# EAGLE design Lighting Board (EAGLE 6.5.0)
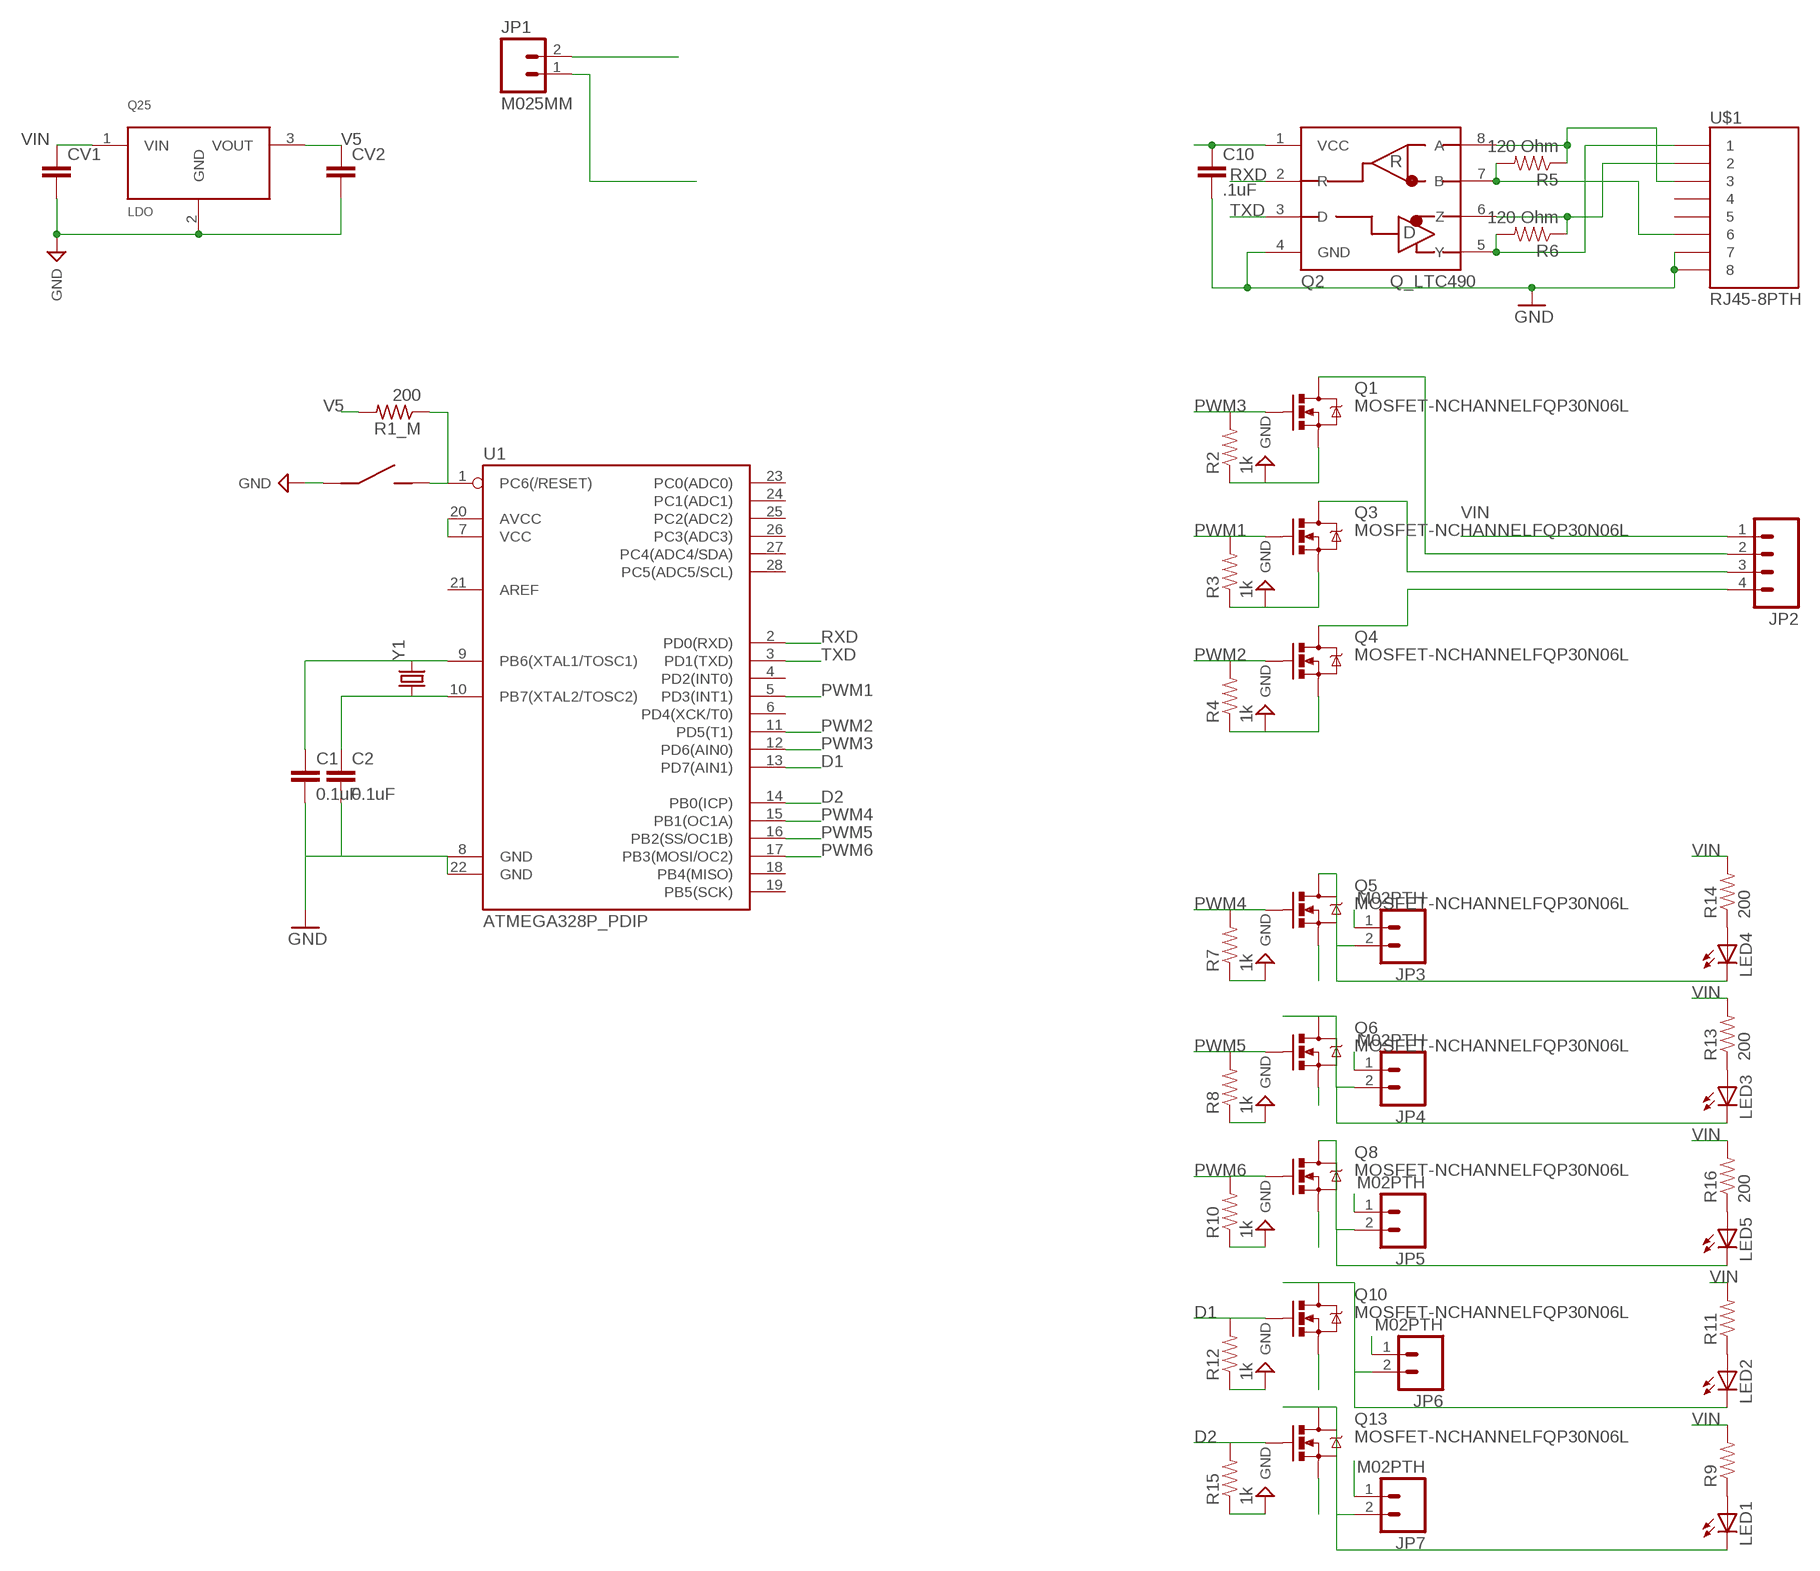
[diagram p0: schematic, sheet 1]

## Parts
C1  0.1uF  CAP1206  [1206]
C2  0.1uF  CAP1206  [1206]
C10  .1uF  2.2UF-CERCAP-10009  [1206]
CV1  C_CAP_0805  [C_0805]
CV2  C_CAP_0805  [C_0805]
JP1  M025MM  [SCREWTERMINAL-5MM-2]
JP2  M04PTH  [1X04]
JP3  M02PTH  [1X02]
JP4  M02PTH  [1X02]
JP5  M02PTH  [1X02]
JP6  M02PTH  [1X02]
JP7  M02PTH  [1X02]
LED1  LED1206  [LED-1206]
LED2  LED1206  [LED-1206]
LED3  LED1206  [LED-1206]
LED4  LED1206  [LED-1206]
LED5  LED1206  [LED-1206]
MS  J_MC32857  [J_TOGGLE]
Q1  MOSFET-NCHANNELFQP30N06L  [TO220V]
Q2  Q_LTC490  [DIP8]
Q3  MOSFET-NCHANNELFQP30N06L  [TO220V]
Q4  MOSFET-NCHANNELFQP30N06L  [TO220V]
Q5  MOSFET-NCHANNELFQP30N06L  [TO220V]
Q6  MOSFET-NCHANNELFQP30N06L  [TO220V]
Q8  MOSFET-NCHANNELFQP30N06L  [TO220V]
Q10  MOSFET-NCHANNELFQP30N06L  [TO220V]
Q13  MOSFET-NCHANNELFQP30N06L  [TO220V]
Q25  LDO  Q_LDO  [TO-220]
R1_M  200  R_RES_0805  [R_0805]
R2  1k  RESISTOR1206  [1206]
R3  1k  RESISTOR1206  [1206]
R4  1k  RESISTOR1206  [1206]
R5  120 Ohm  RESISTOR1206  [1206]
R6  120 Ohm  RESISTOR1206  [1206]
R7  1k  RESISTOR1206  [1206]
R8  1k  RESISTOR1206  [1206]
R9  RESISTOR1206  [1206]
R10  1k  RESISTOR1206  [1206]
R11  RESISTOR1206  [1206]
R12  1k  RESISTOR1206  [1206]
R13  200  RESISTOR1206  [1206]
R14  200  RESISTOR1206  [1206]
R15  1k  RESISTOR1206  [1206]
R16  200  RESISTOR1206  [1206]
U1  ATMEGA328P_PDIP  [DIL28-3]
U$1  RJ45-8PTH  [RJ45-8]
Y1  CRYSTALHC49US  [HC49US]

## Nets
D1: Q10.1(G) R12.2 U1.13(PD7(AIN1))
D2: Q13.1(G) R15.2 U1.14(PB0(ICP))
GND: C1.2 C2.2 C10.2 CV1.2 CV2.2 JP1.2 MS.P$1 Q1.3(S) Q2.4(GND) Q3.3(S) Q4.3(S) Q5.3(S) Q6.3(S) Q8.3(S) Q10.3(S) Q13.3(S) Q25.2(GND) R2.1 R3.1 R4.1 R7.1 R8.1 R10.1 R12.1 R15.1 U1.8(GND) U1.22(GND) U$1.7 U$1.8 ; supply symbol labelled SUP_GND
N$1: Q2.5(Y) R6.2 U$1.1
N$2: C2.1 U1.10(PB7(XTAL2/TOSC2)) Y1.1
N$4: LED1.A R9.1
N$5: LED2.A R11.1
N$6: LED3.A R13.1
N$7: LED4.A R14.1
N$8: LED5.A R16.1
N$9: Q2.6(Z) R6.1 U$1.2
N$10: Q2.7(B) R5.2 U$1.6
N$11: Q2.8(A) R5.1 U$1.3
N$13: C1.1 U1.9(PB6(XTAL1/TOSC1)) Y1.2
N$15: JP2.2 Q1.2(D)
N$16: JP2.3 Q3.2(D)
N$17: JP2.4 Q4.2(D)
N$88: MS.P$2 R1_M.1 U1.1(PC6(/RESET))
N%2: JP4.2 LED3.C Q6.2(D)
N%3: JP3.2 LED4.C Q5.2(D)
N%106: JP5.2 LED5.C Q8.2(D)
N%107: JP6.2 LED2.C Q10.2(D)
N%110: JP7.2 LED1.C Q13.2(D)
PWM1: Q3.1(G) R3.2 U1.5(PD3(INT1))
PWM2: Q4.1(G) R4.2 U1.11(PD5(T1))
PWM3: Q1.1(G) R2.2 U1.12(PD6(AIN0))
PWM4: Q5.1(G) R7.2 U1.15(PB1(OC1A))
PWM5: Q6.1(G) R8.2 U1.16(PB2(SS/OC1B))
PWM6: Q8.1(G) R10.2 U1.17(PB3(MOSI/OC2))
RXD: Q2.2(R) U1.2(PD0(RXD))
TXD: Q2.3(D) U1.3(PD1(TXD))
V5: C10.1 CV2.1 Q2.1(VCC) Q25.3(VOUT) R1_M.2 U1.7(VCC) U1.20(AVCC)
VIN: CV1.1 JP1.1 JP2.1 JP3.1 JP4.1 JP5.1 JP6.1 JP7.1 Q25.1(VIN) R9.2 R11.2 R13.2 R14.2 R16.2
Unconnected: U1.4(PD2(INT0)) U1.6(PD4(XCK/T0)) U1.18(PB4(MISO)) U1.19(PB5(SCK)) U1.21(AREF) U1.23(PC0(ADC0)) U1.24(PC1(ADC1)) U1.25(PC2(ADC2)) U1.26(PC3(ADC3)) U1.27(PC4(ADC4/SDA)) U1.28(PC5(ADC5/SCL)) U$1.4 U$1.5

## Library data of the parts
C1 C2 = SparkFun-Passives:CAP: Capacitor Standard 0603 ceramic capacitor, and 0.1" leaded capacitor.
C10 = SparkFun-Retired:2.2UF-CER: 2.2uF Ceramic SMT CAP-07888- 10V, 20% (0603) CAP-10009- 50V, 10% (1206); PROD_ID: CAP-10009; VALUE: 2.2uF
CV1 CV2 = Lib_Passive:C_CAP
JP1 JP3-JP7 = SparkFun-Connectors:M02: Standard 2-pin 0.1" header. Use with - straight break away headers ( PRT-00116) - right angle break away headers (PRT-00553) - swiss pins (PRT-00743) - machine pins (PRT-00117) - female headers (PRT-00115) Molex polarized connector foot print use with: PRT-08233 with associated crimp pins and housings. 2.54_SCREWTERM for use with PRT-10571. 3.5mm Screw Terminal footprints for PRT-08084 5mm Screw Terminal footprints for use with PRT-08433
JP2 = SparkFun-Connectors:M04: Header 4 Standard 4-pin 0.1" header. Use with straight break away headers (SKU : PRT-00116), right angle break away headers (PRT-00553), swiss pins (PRT-00743), machine pins (PRT-00117), and female headers (PRT-00115). Molex polarized connector foot print use with SKU : PRT-08231 with associated crimp pins and housings. 1MM SMD Version SKU: PRT-10208
LED1-LED5 = LilyPad-Wearables:LED: LEDs Standard schematic elements and footprints for 5mm, 3mm, 1206, and 0603 sized LEDs. 5mm - Spark Fun Electronics SKU : Comp-SBL
MS = PCB0M1:J_MC32857: SWITCH, TACTILE, SPST-NO, 50mA, THD
Q1 Q3-Q6 Q8 Q10 Q13 = SparkFun-DiscreteSemi:MOSFET-NCHANNEL: Common NMOSFET Parts MFG P/N Store ID Prod ID FDD8780 TRANS-09984 SI7820DN TRANS-11055 FDS6630A IC-08089 2N7002PW TRANS-11151 FQP30N06L COM-10213 TRANS-10060 BSS123LT1G TRANS-08345 BSS138 TRANS-00830 BS170 2N7000; PROD_ID: TRANS-10060
Q2 = PCB0M1:Q_LTC490: IC, RS422-RS485 DRVR
Q25 = PCB0M1:Q_LDO: LDO with fixed ouput voltage
R1_M = Lib_Passive:R_RES
R2-R16 = SparkFun-Passives:RESISTOR: Resistor Basic schematic elements and footprints for 0603, 1206, and PTH resistors.
U1 = SparkFun-DigitalIC:ATMEGA328P_PDIP: uC used in the Arduino 32kb flash, 1k EEPROM, 2k SRAM This is the through-hole version of this chip.
U$1 = SparkFun-Connectors:RJ45-8: RJ45 Jack Simple RJ45, 8-pin connection - connector for common Cat5, Cat5e, and Cat6 Ethernet cables. Footprint not yet proven in production. Connector sku is PRT-00643; Breakout PCB sku is BOB-00716.
Y1 = SparkFun-FreqCtrl:CRYSTAL: Various standard crystals. Proven footprints. Spark Fun Electronics SKU : COM-00534

## Board
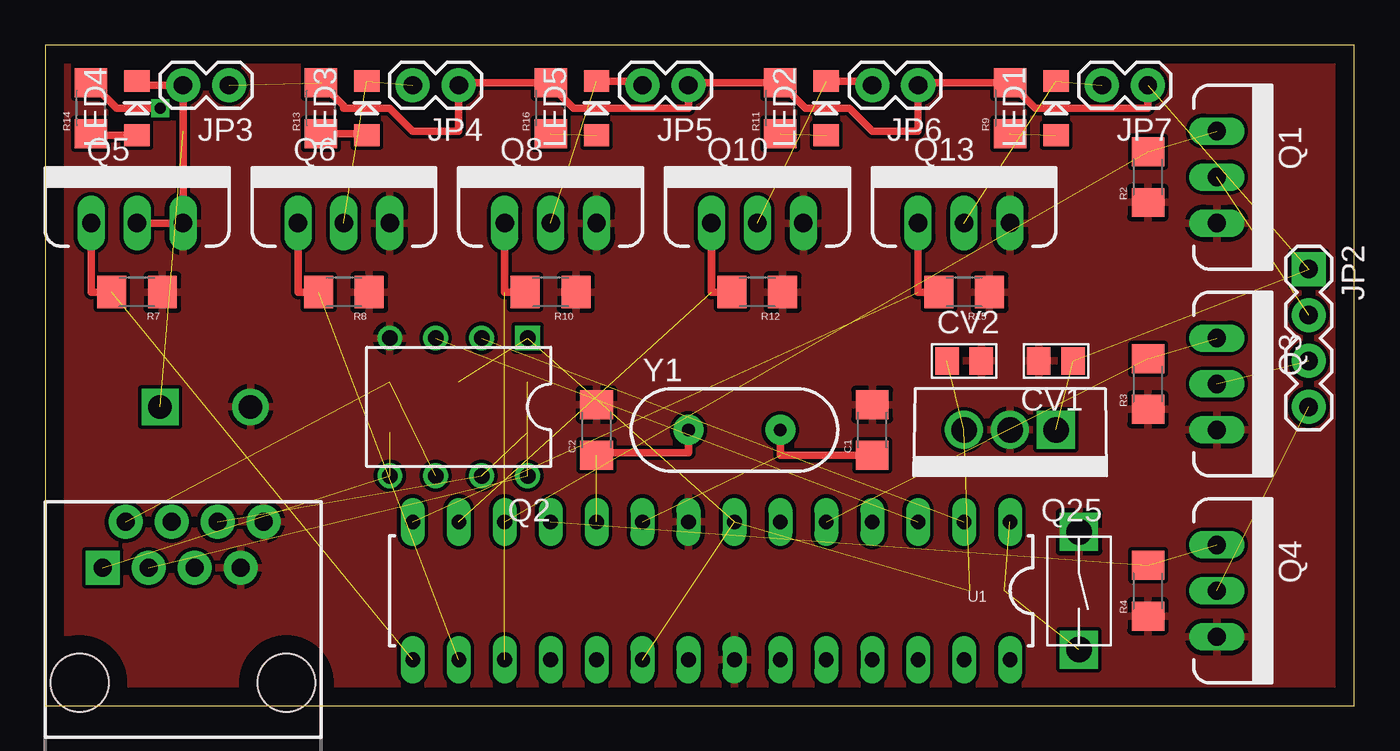
[diagram p1: board, top side]
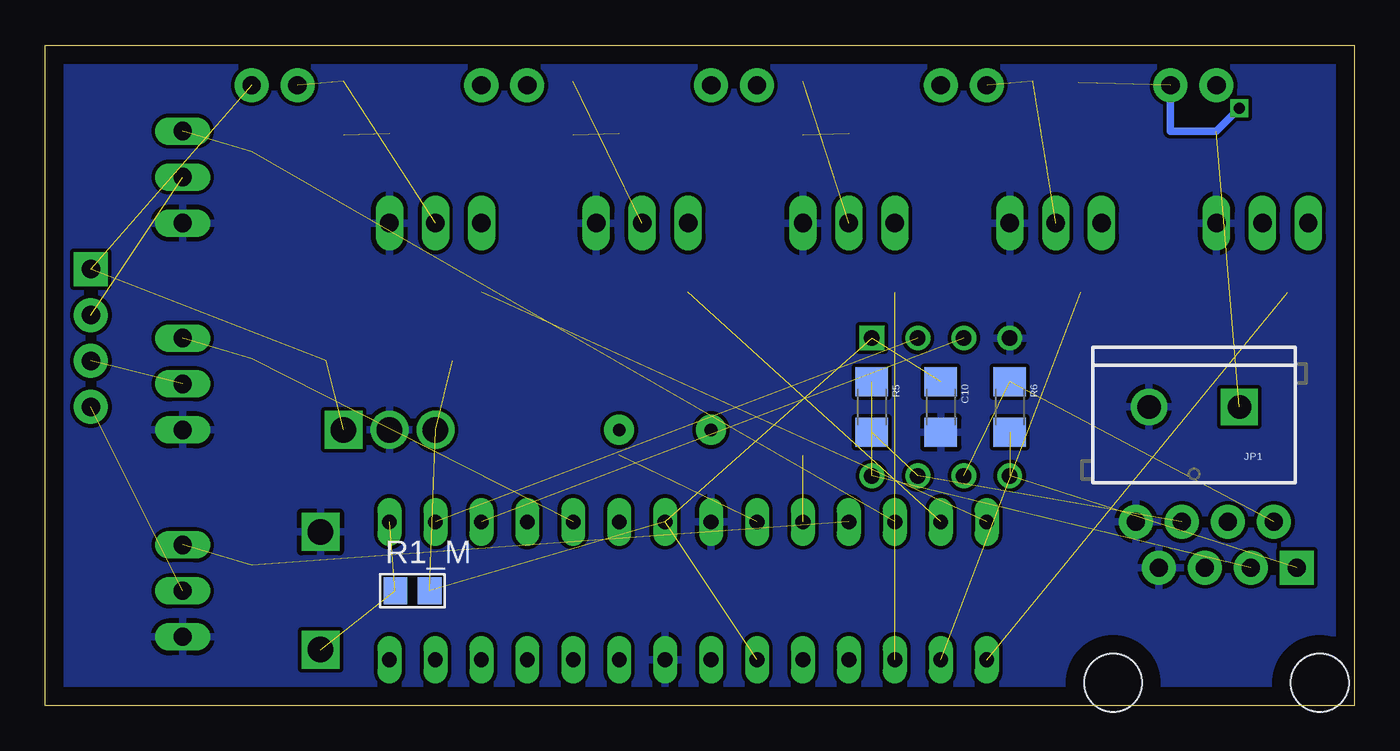
[diagram p2: board, bottom side, seen from below]

Size 72.37 x 36.5 mm. Coordinates in mm from the lower left corner, seen from the top.
Outline: 0,0 72.37,0 72.37,36.5 0,36.5 0,0
Copper layers (1*16): Top 0.035mm / dielectric 1.5mm / Bottom 0.035mm
Design rules "default": minimum track width 10mil, minimum drill 24mil, track to track 8mil, track to pad 8mil, pad to pad 8mil, via to via 8mil, smd to smd 8mil, copper to edge 40mil, drill to drill 8mil, minimum pad ring 10mil, minimum via ring 8mil, stop-mask expansion 4mil, vias tented up to drill 0mil, thermal gap 10mil

### Footprints (pad centres in the part's own frame; a part is rotated, then mirrored left to right if it is on the bottom)
1206 = smd 1.6 x 1.8: 1 -1.4,0; 2 1.4,0
C_0805 = smd 1.3 x 1.5: 1 -0.95,0; 2 0.95,0
SCREWTERMINAL-5MM-2 = drill 1.3 pad 2.032 square: 1 0,0 | drill 1.3 pad 2.032: 2 5,0
1X04 = drill 1.016 pad 1.88 square: 1 0,0 | drill 1.016 pad 1.88: 2 2.54,0; 3 5.08,0; 4 7.62,0
1X02 = drill 1.016 pad 1.88: 1 0,0; 2 2.54,0
LED-1206 = smd 1.2 x 1.4: A -1.5,0; C 1.5,0
J_TOGGLE = drill 1.4 square: P$1 -3.25,0; P$2 3.25,0
TO220V = drill 1.016 long: 1 -2.54,0; 2 0,0; 3 2.54,0
DIP8 = drill 0.864 square: 1 -3.81,-3.81 | drill 0.864: 2 -1.27,-3.81; 3 1.27,-3.81; 4 3.81,-3.81; 5 3.81,3.81; 6 1.27,3.81; 7 -1.27,3.81; 8 -3.81,3.81
TO-220 = drill 1.397 square: 1 -2.54,0 | drill 1.397: 2 0,0; 3 2.54,0
R_0805 = smd 1.3 x 1.5: 1 -0.95,0; 2 0.95,0
DIL28-3 = drill 0.813 long: 1 -16.51,-3.81; 2 -13.97,-3.81; 3 -11.43,-3.81; 4 -8.89,-3.81; 5 -6.35,-3.81; 6 -3.81,-3.81; 7 -1.27,-3.81; 8 1.27,-3.81; 9 3.81,-3.81; 10 6.35,-3.81; 11 8.89,-3.81; 12 11.43,-3.81; 13 13.97,-3.81; 14 16.51,-3.81; 15 16.51,3.81; 16 13.97,3.81; 17 11.43,3.81; 18 8.89,3.81; 19 6.35,3.81; 20 3.81,3.81; 21 1.27,3.81; 22 -1.27,3.81; 23 -3.81,3.81; 24 -6.35,3.81; 25 -8.89,3.81; 26 -11.43,3.81; 27 -13.97,3.81; 28 -16.51,3.81
RJ45-8 = drill 1 pad 1.88 square: 1 -4.445,6.35 | drill 1 pad 1.88: 2 -3.175,8.89; 3 -1.905,6.35; 4 -0.635,8.89; 5 0.635,6.35; 6 1.905,8.89; 7 3.175,6.35; 8 4.445,8.89 | hole 3.2: -5.715,0; 5.715,0
HC49US = drill 0.7 pad 1.651: 1 -2.54,0; 2 2.54,0

### Placement (x,y rotation side)
C1  45.72,15.24 90 top
C2  30.48,15.24 90 top
C10  22.86,16.51 270 bottom
CV1  55.88,19.05 180 top
CV2  50.8,19.05 0 top
JP1  6.35,16.51 180 bottom
JP2  69.85,24.13 270 top
JP3  10.16,34.29 180 top
JP4  22.86,34.29 180 top
JP5  35.56,34.29 180 top
JP6  48.26,34.29 180 top
JP7  60.96,34.29 180 top
LED1  55.88,33.02 90 top
LED2  43.18,33.02 90 top
LED3  17.78,33.02 90 top
LED4  5.08,33.02 90 top
LED5  30.48,33.02 90 top
MS  57.15,6.35 270 top
Q1  64.77,29.21 270 top
Q2  22.86,16.51 180 top
Q3  64.77,17.78 270 top
Q4  64.77,6.35 270 top
Q5  5.08,26.67 0 top
Q6  16.51,26.67 0 top
Q8  27.94,26.67 0 top
Q10  39.37,26.67 0 top
Q13  50.8,26.67 0 top
Q25  53.34,15.24 180 top
R1_M  52.07,6.35 0 bottom
R2  60.96,29.21 90 top
R3  60.96,17.78 90 top
R4  60.96,6.35 90 top
R5  26.67,16.51 270 bottom
R6  19.05,16.51 270 bottom
R7  5.08,22.86 180 top
R8  16.51,22.86 180 top
R9  53.34,33.02 90 top
R10  27.94,22.86 180 top
R11  40.64,33.02 90 top
R12  39.37,22.86 180 top
R13  15.24,33.02 90 top
R14  2.54,33.02 90 top
R15  50.8,22.86 180 top
R16  27.94,33.02 90 top
U1  36.83,6.35 180 top
U$1  7.62,1.27 0 top
Y1  38.1,15.24 0 top

### Tracks (layer width: path | path; a pad name or v marks a point on that pad's centre or on a via)
D1  (1 unrouted)
  Top 0.406: R12.2 36.83,22.86 Q10.1
D2  (1 unrouted)
  Top 0.406: Q13.1 48.26,22.86 R15.2
GND
  pour Bottom: 0,0 72.39,0 72.39,36.83 0,36.83
  pour Top: 0,0 72.39,0 72.39,36.83 0,36.83
N$1  (2 unrouted)
N$2  (1 unrouted)
  Top 0.406: Y1.1 35.56,13.97 30.48,13.97 C2.1
N$4  (1 unrouted)
N$5  (1 unrouted)
N$6
  Top 0.406: LED3.A 17.68,31.62 R13.1
N$7
  Top 0.406: R14.1 2.64,31.52 LED4.A
N$8  (1 unrouted)
N$9  (2 unrouted)
N$10  (2 unrouted)
N$11  (2 unrouted)
N$13  (1 unrouted)
  Top 0.406: C1.1 40.64,13.84 Y1.2
N$15  (1 unrouted)
N$16  (1 unrouted)
N$17  (1 unrouted)
N$88  (2 unrouted)
N%2  (2 unrouted)
N%3
  Top 0.406: Q5.2 7.62,26.67 JP3.2 5.08,34.29 LED4.C
N%106  (1 unrouted)
  Top 0.406: JP5.2 32.79,34.52 LED5.C
N%107  (1 unrouted)
  Top 0.406: JP6.2 45.49,34.52 LED2.C
N%110  (2 unrouted)
PWM1  (2 unrouted)
PWM2  (2 unrouted)
PWM3  (2 unrouted)
PWM4  (1 unrouted)
  Top 0.406: Q5.1 2.54,22.86 R7.2
PWM5  (1 unrouted)
  Top 0.406: Q6.1 13.97,22.86 R8.2
PWM6  (1 unrouted)
  Top 0.406: Q8.1 25.4,22.86 R10.2
RXD  (1 unrouted)
TXD  (1 unrouted)
V5  (6 unrouted)
VIN  (via drill 0.6)  (5 unrouted)
  Top 0.406: R14.2 3.94,33.02 v6.35,33.02 | R13.2 16.51,33.15 16.51,33.02 19.05,33.02 20.32,31.75 22.86,31.75 JP4.1 22.99,34.42 R16.2 27.94,34.29 29.21,33.02 35.56,33.02 JP5.1 35.69,34.42 R11.2 42.04,33.02 44.45,33.02 45.72,31.75 48.26,31.75 JP6.1 48.39,34.42 R9.2 54.74,33.02 60.96,33.02 JP7.1
  Bottom 0.406: v6.35,33.02 7.62,31.75 10.16,31.75 JP3.1